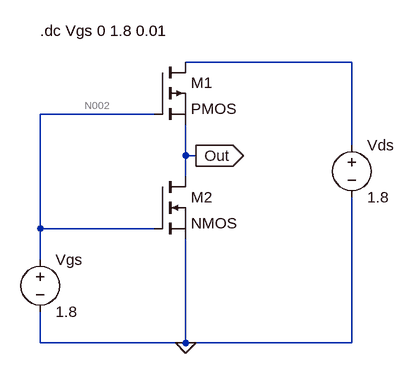
[diagram p0: schematic Draft1.asc]
Draft1.asc, the LTspice schematic file:
Version 4
SHEET 1 880 680
WIRE 448 48 192 48
WIRE 144 128 -32 128
WIRE 448 176 448 48
WIRE 192 192 192 144
WIRE 208 192 192 192
WIRE 192 224 192 192
WIRE -32 304 -32 128
WIRE 144 304 -32 304
WIRE -32 352 -32 304
WIRE -32 480 -32 432
WIRE 192 480 192 320
WIRE 192 480 -32 480
WIRE 448 480 448 256
WIRE 448 480 192 480
FLAG 192 480 0
FLAG 208 192 Out
IOPIN 208 192 Out
SYMBOL pmos 144 48 R0
SYMATTR InstName M1
SYMBOL nmos 144 224 R0
SYMATTR InstName M2
SYMBOL voltage -32 336 R0
SYMATTR InstName Vgs
SYMATTR Value 1.8
SYMBOL voltage 448 160 R0
SYMATTR InstName Vds
SYMATTR Value 1.8
TEXT -32 0 Left 2 !.dc Vgs 0 1.8 0.01

The netlist it stands for:
* Draft1.asc
M1 N001 N002 Out Out PMOS
M2 Out N002 0 0 NMOS
Vgs N002 0 1.8
Vds N001 0 1.8
.model NMOS NMOS
.model PMOS PMOS
.lib standard.mos
.dc Vgs 0 1.8 0.01
.backanno
.end

* Results of the author's LTspice run, read from the files saved beside the schematic
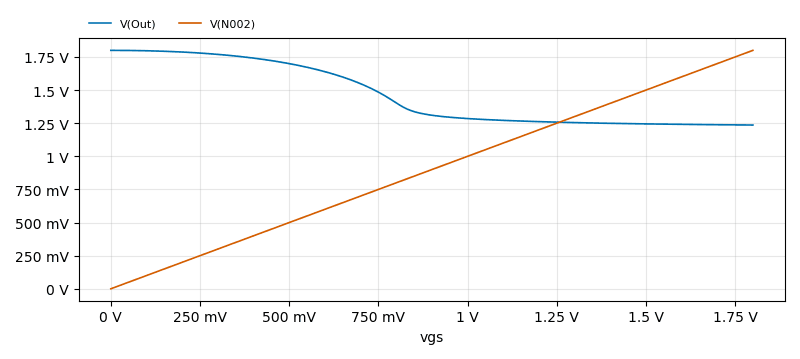
[diagram p1: DC transfer characteristic of Draft1.asc, plotted from the saved traces]
* DC transfer characteristic, 1 run:
*   V(Out): 1.8 V at vgs=0 V, 1.236 V at vgs=1.8 V, min 1.236 V, max 1.8 V
*   V(N002): 0 V at vgs=0 V, 1.8 V at vgs=1.8 V, min 0 V, max 1.8 V